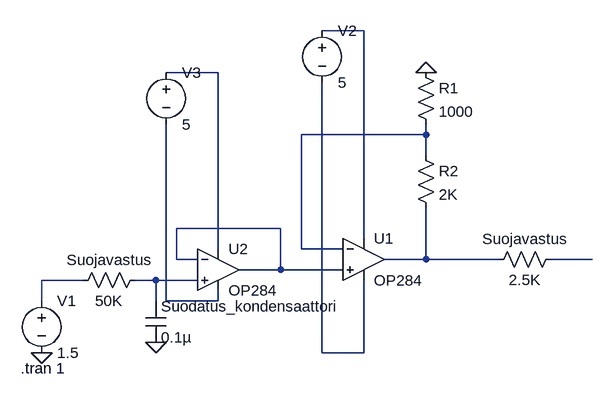
[diagram p0: schematic AnalogLampotila.asc]
AnalogLampotila.asc, the LTspice schematic file:
Version 4.1
SHEET 1 880 680
WIRE 240 -192 176 -192
WIRE 16 -128 -64 -128
WIRE 336 -32 336 -48
WIRE 336 -32 144 -32
WIRE 336 0 336 -32
WIRE 112 112 -48 112
WIRE 240 128 240 -192
WIRE 16 144 16 -128
WIRE 144 144 144 -32
WIRE 208 144 144 144
WIRE -48 160 -48 112
WIRE -16 160 -48 160
WIRE 336 160 336 80
WIRE 336 160 272 160
WIRE 448 160 336 160
WIRE 592 160 528 160
WIRE 112 176 112 112
WIRE 112 176 48 176
WIRE 208 176 112 176
WIRE -192 192 -256 192
WIRE -80 192 -112 192
WIRE -16 192 -80 192
WIRE -256 224 -256 192
WIRE -80 224 -80 192
WIRE -64 224 -64 -48
WIRE 16 224 16 208
WIRE 16 224 -64 224
WIRE 176 304 176 -112
WIRE 240 304 240 192
WIRE 240 304 176 304
FLAG 336 -128 0
FLAG -256 304 0
FLAG -80 288 0
SYMBOL OpAmps\\OP284 240 96 R0
SYMATTR InstName U1
SYMBOL res 320 -16 R0
SYMATTR InstName R2
SYMATTR Value 2K
SYMBOL res 320 -144 R0
SYMATTR InstName R1
SYMATTR Value 1000
SYMBOL OpAmps\\OP284 16 112 R0
SYMATTR InstName U2
SYMBOL res -96 176 R90
WINDOW 0 0 56 VBottom 2
WINDOW 3 32 56 VTop 2
SYMATTR InstName Suojavastus
SYMATTR Value 50K
SYMBOL voltage -256 208 R0
WINDOW 123 0 0 Left 0
WINDOW 39 0 0 Left 0
SYMATTR InstName V1
SYMATTR Value 1.5
SYMBOL res 544 144 R90
WINDOW 0 0 56 VBottom 2
WINDOW 3 32 56 VTop 2
SYMATTR InstName Suojavastus
SYMATTR Value 2.5K
SYMBOL cap -96 224 R0
SYMATTR InstName Suodatus_kondensaattori
SYMATTR Value 0.1µ
SYMBOL voltage 176 -208 R0
WINDOW 123 0 0 Left 0
WINDOW 39 0 0 Left 0
SYMATTR InstName V2
SYMATTR Value 5
SYMBOL voltage -64 -144 R0
WINDOW 123 0 0 Left 0
WINDOW 39 0 0 Left 0
SYMATTR InstName V3
SYMATTR Value 5
TEXT -288 328 Left 2 !.tran 1

The netlist it stands for:
* AnalogLampotila.asc
X§U1 N004 N003 N001 N010 N005 OP284  ; pins In+ In- V+ V- OUT
R2 N003 N005 2K
R1 0 N003 1000
X§U2 N008 N004 N002 N009 N004 OP284  ; pins In+ In- V+ V- OUT
R§Suojavastus N008 N007 50K
V1 N007 0 1.5
R§Suojavastus N006 N005 2.5K
C§Suodatus_kondensaattori N008 0 0.1µ
V2 N001 N010 5
V3 N002 N009 5
.tran 1
.lib ADI1.lib
.backanno
.end